# EAGLE design ir-leds (EAGLE 9.1.3)
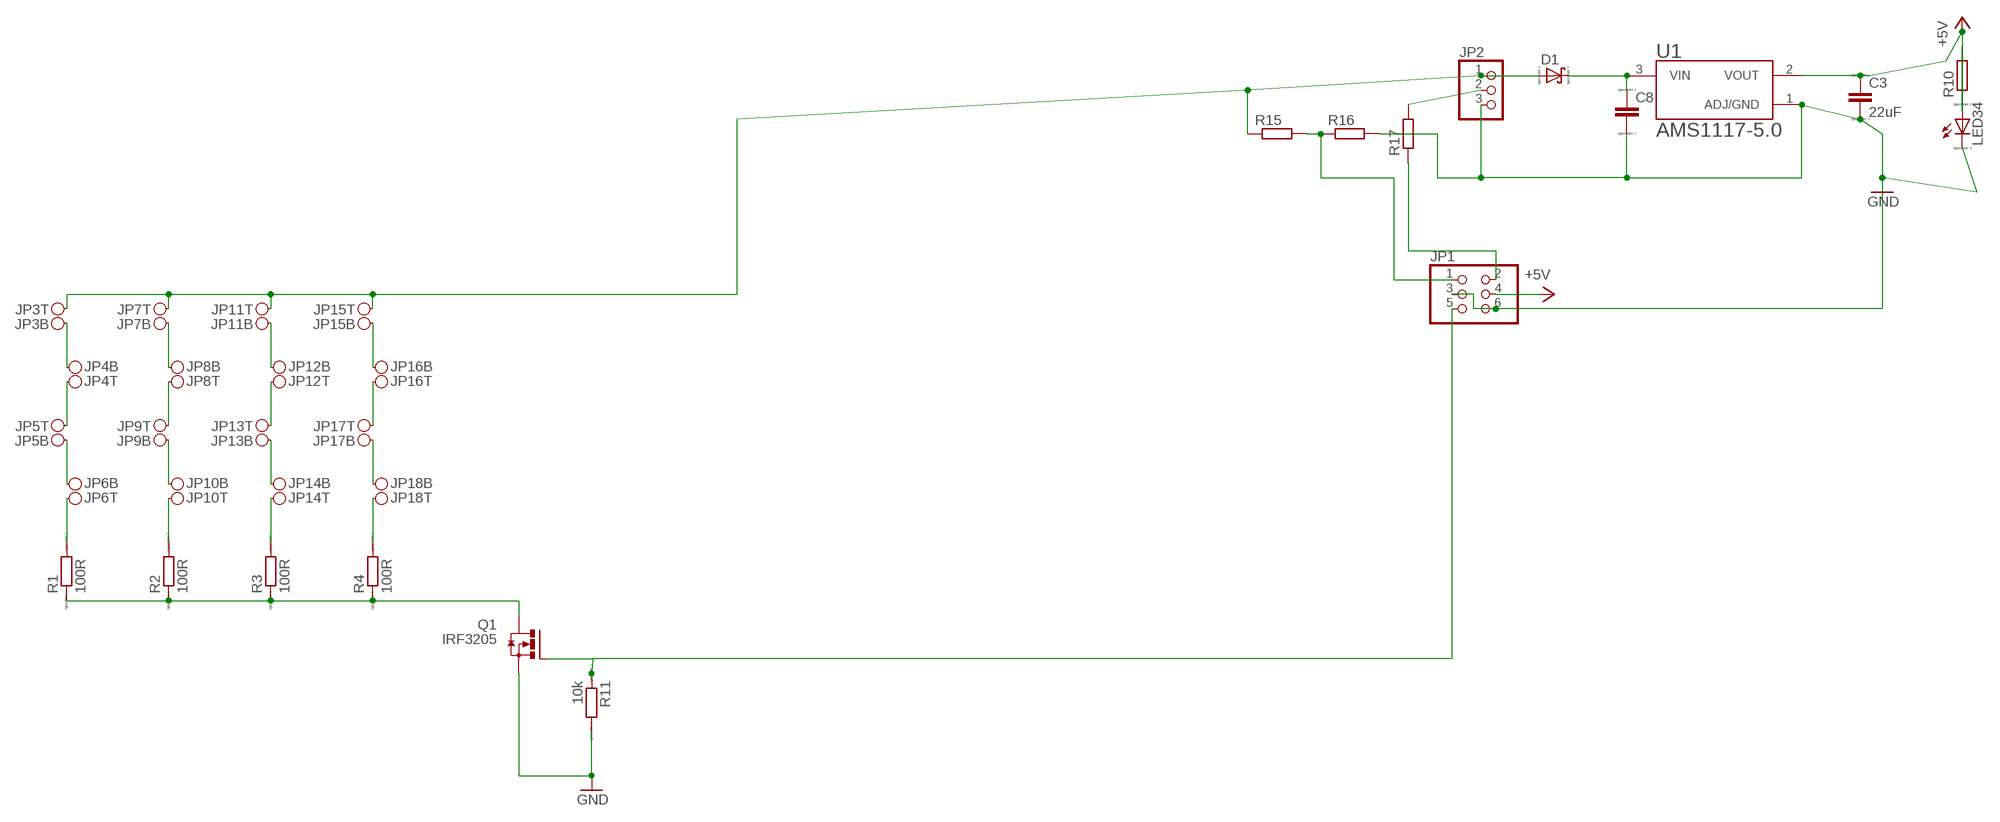
[diagram p0: schematic, sheet 1]

## Parts
C3  22uF  CC1206  [C1206]
C8  CC1206  [C1206]
D1  SCHOTTKY-DIODEF126Z12  [DIODE_F126Z12]
JP1  PINHD-2X3  [2X03]
JP2  PINHD-1X3  [1X03]
JP3  PINH2X01  [PINH2X01SMD]
JP4  PINH2X01  [PINH2X01SMD]
JP5  PINH2X01  [PINH2X01SMD]
JP6  PINH2X01  [PINH2X01SMD]
JP7  PINH2X01  [PINH2X01SMD]
JP8  PINH2X01  [PINH2X01SMD]
JP9  PINH2X01  [PINH2X01SMD]
JP10  PINH2X01  [PINH2X01SMD]
JP11  PINH2X01  [PINH2X01SMD]
JP12  PINH2X01  [PINH2X01SMD]
JP13  PINH2X01  [PINH2X01SMD]
JP14  PINH2X01  [PINH2X01SMD]
JP15  PINH2X01  [PINH2X01SMD]
JP16  PINH2X01  [PINH2X01SMD]
JP17  PINH2X01  [PINH2X01SMD]
JP18  PINH2X01  [PINH2X01SMD]
LED34  LED_E  [LED_1206]
Q1  IRF3205  IRF3704L-V  [TO262-V]
R1  100R  RR1206  [R1206]
R2  100R  RR1206  [R1206]
R3  100R  RR1206  [R1206]
R4  100R  RR1206  [R1206]
R10  R-EU_R1206  [R1206]
R11  10k  RR1206  [R1206]
R15  R-EU_R1206  [R1206]
R16  R-EU_R1206  [R1206]
R17  R-EU_R1206  [R1206]
U1  AMS1117-5.0  [SOT229P700X180-4N]

## Nets
+5V: C3.1 JP1.4 R10.2 U1.2(VOUT)
GND: C3.2 C8.2 JP1.3 JP1.6 JP2.3 LED34.C Q1.3(S) R11.2 R16.2 U1.1(ADJ/GND)
N$1: JP3.B1 JP4.B1
N$2: JP4.T1 JP5.T1
N$3: JP5.B1 JP6.B1
N$4: JP6.T1 R1.2
N$5: JP10.T1 R2.2
N$6: JP9.B1 JP10.B1
N$7: JP8.T1 JP9.T1
N$8: JP7.B1 JP8.B1
N$9: JP11.B1 JP12.B1
N$10: JP12.T1 JP13.T1
N$11: JP13.B1 JP14.B1
N$12: JP14.T1 R3.2
N$13: JP15.B1 JP16.B1
N$14: JP16.T1 JP17.T1
N$15: JP17.B1 JP18.B1
N$16: JP18.T1 R4.2
N$17: JP1.2 R17.1
N$33: D1.A(C) JP2.1 JP3.T1 JP7.T1 JP11.T1 JP15.T1 R15.1
N$34: JP1.5 Q1.1(G) R11.1
N$35: Q1.2(D) R1.1 R2.1 R3.1 R4.1
N$36: LED34.A R10.1
N$38: JP2.2 R17.2
N$39: JP1.1 R15.2 R16.1
N$44: C8.1 D1.C(A) U1.3(VIN)

## Library data of the parts
C3 C8 = eagle-ltspice:C: CAPACITOR, European symbol; SPICEMODEL: NONE; SPICEPREFIX: C
D1 = eagle-ltspice:SCHOTTKY-DIODE: Schottky Diode; SPICEMODEL: NONE; SPICEPREFIX: D; SPICETYPE: diode
JP1 = pinhead:PINHD-2X3: PIN HEADER
JP2 = pinhead:PINHD-1X3: PIN HEADER
JP3-JP18 = pinhead_smd:PINH2X01
LED34 = eagle-ltspice:LED_E: LED Source: http://www.osram.convergy.de Source: www.luxeon.com Source: www.kingbright.com; SPICEMODEL: NONE; SPICEPREFIX: D; SPICETYPE: diode
Q1 = transistor-power:IRF3704: SMPS MOSFET HEXFET® Power MOSFET Source: http://www.irf.com/product-info/datasheets/data/irf3704.pdf
R1-R4 R11 = eagle-ltspice:R: RESISTOR, European symbol; SPICEMODEL: NONE; SPICEPREFIX: R
R10 R15-R17 = resistor:R-EU_: RESISTOR, European symbol
U1 = AMS1117-5.0:AMS1117-5.0: Sot223/Pkg 1-Amp 5-Volt Low Drop Out Voltage Regulatator; AVAILABILITY: Unavailable; DESCRIPTION: Sot223/Pkg 1-Amp 5-Volt Low Drop Out Voltage Regulatator; MF: Advanced Monolithic Systems; MP: AMS1117-5.0; PACKAGE: None; PRICE: None

## Net classes
0 default: width 0.406 mm

## Board
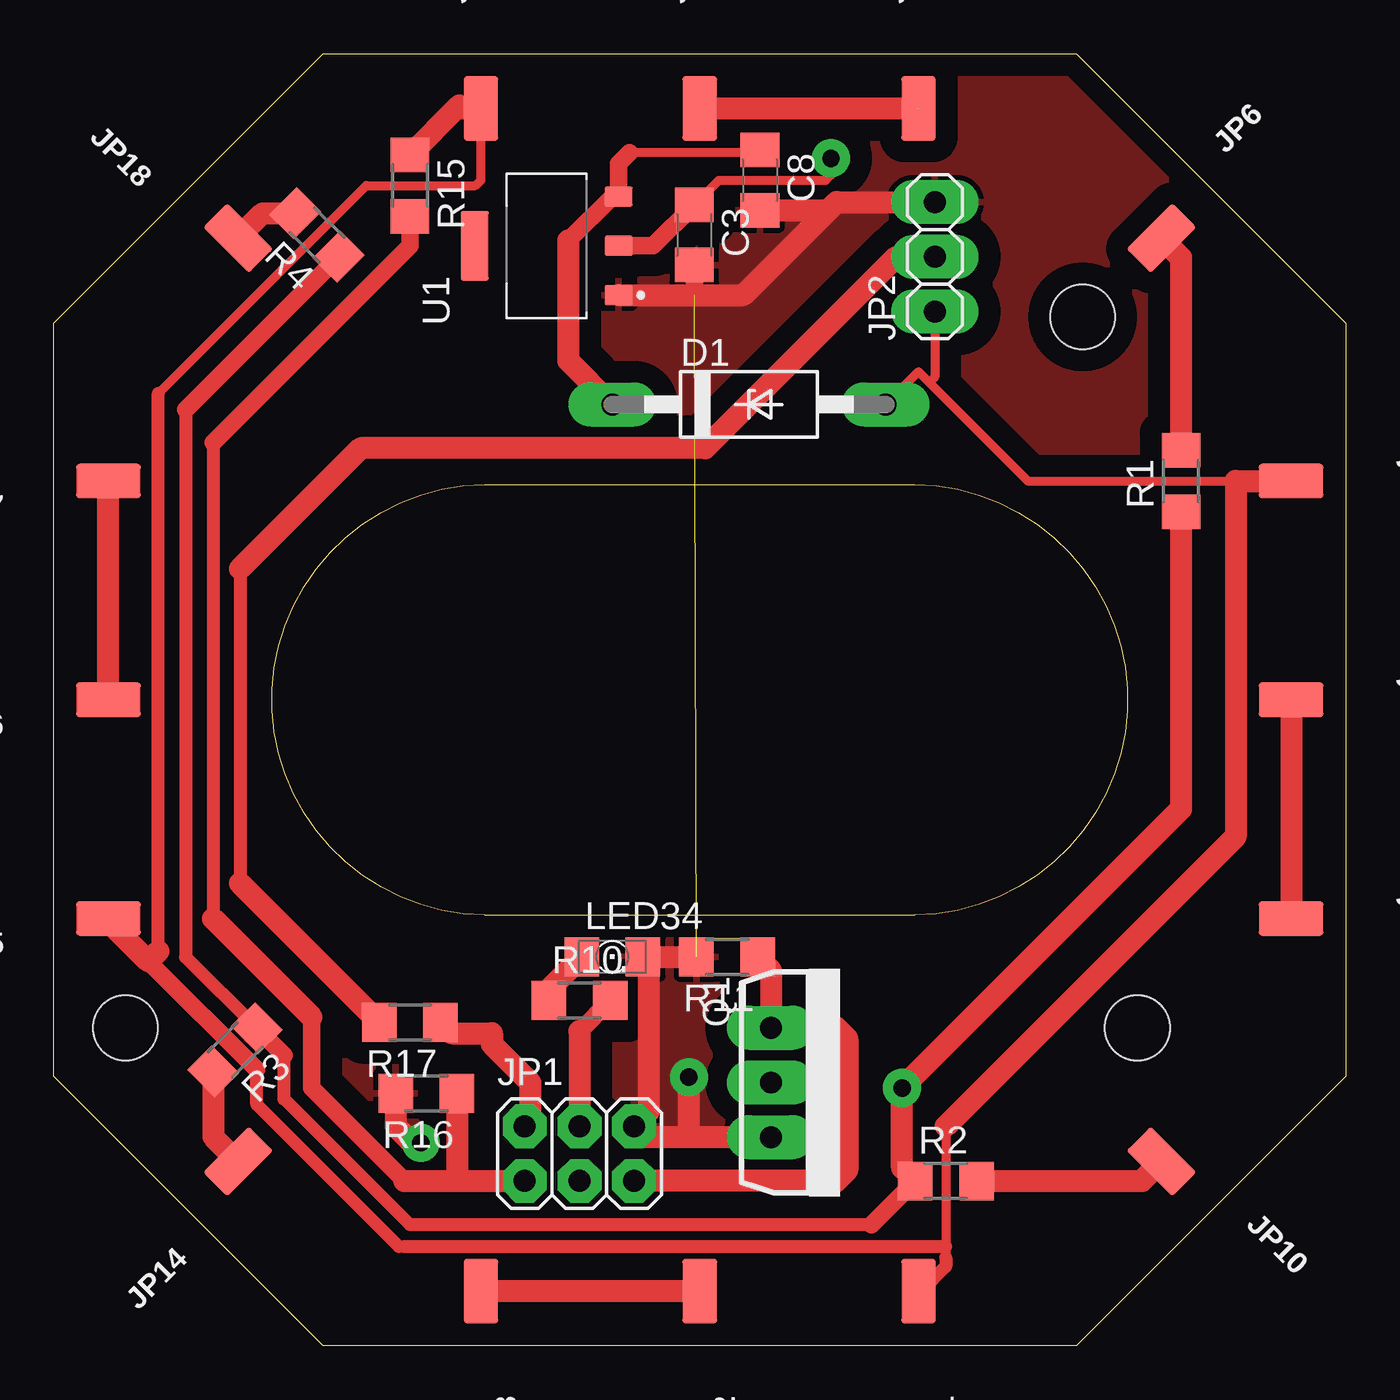
[diagram p1: board, top side]
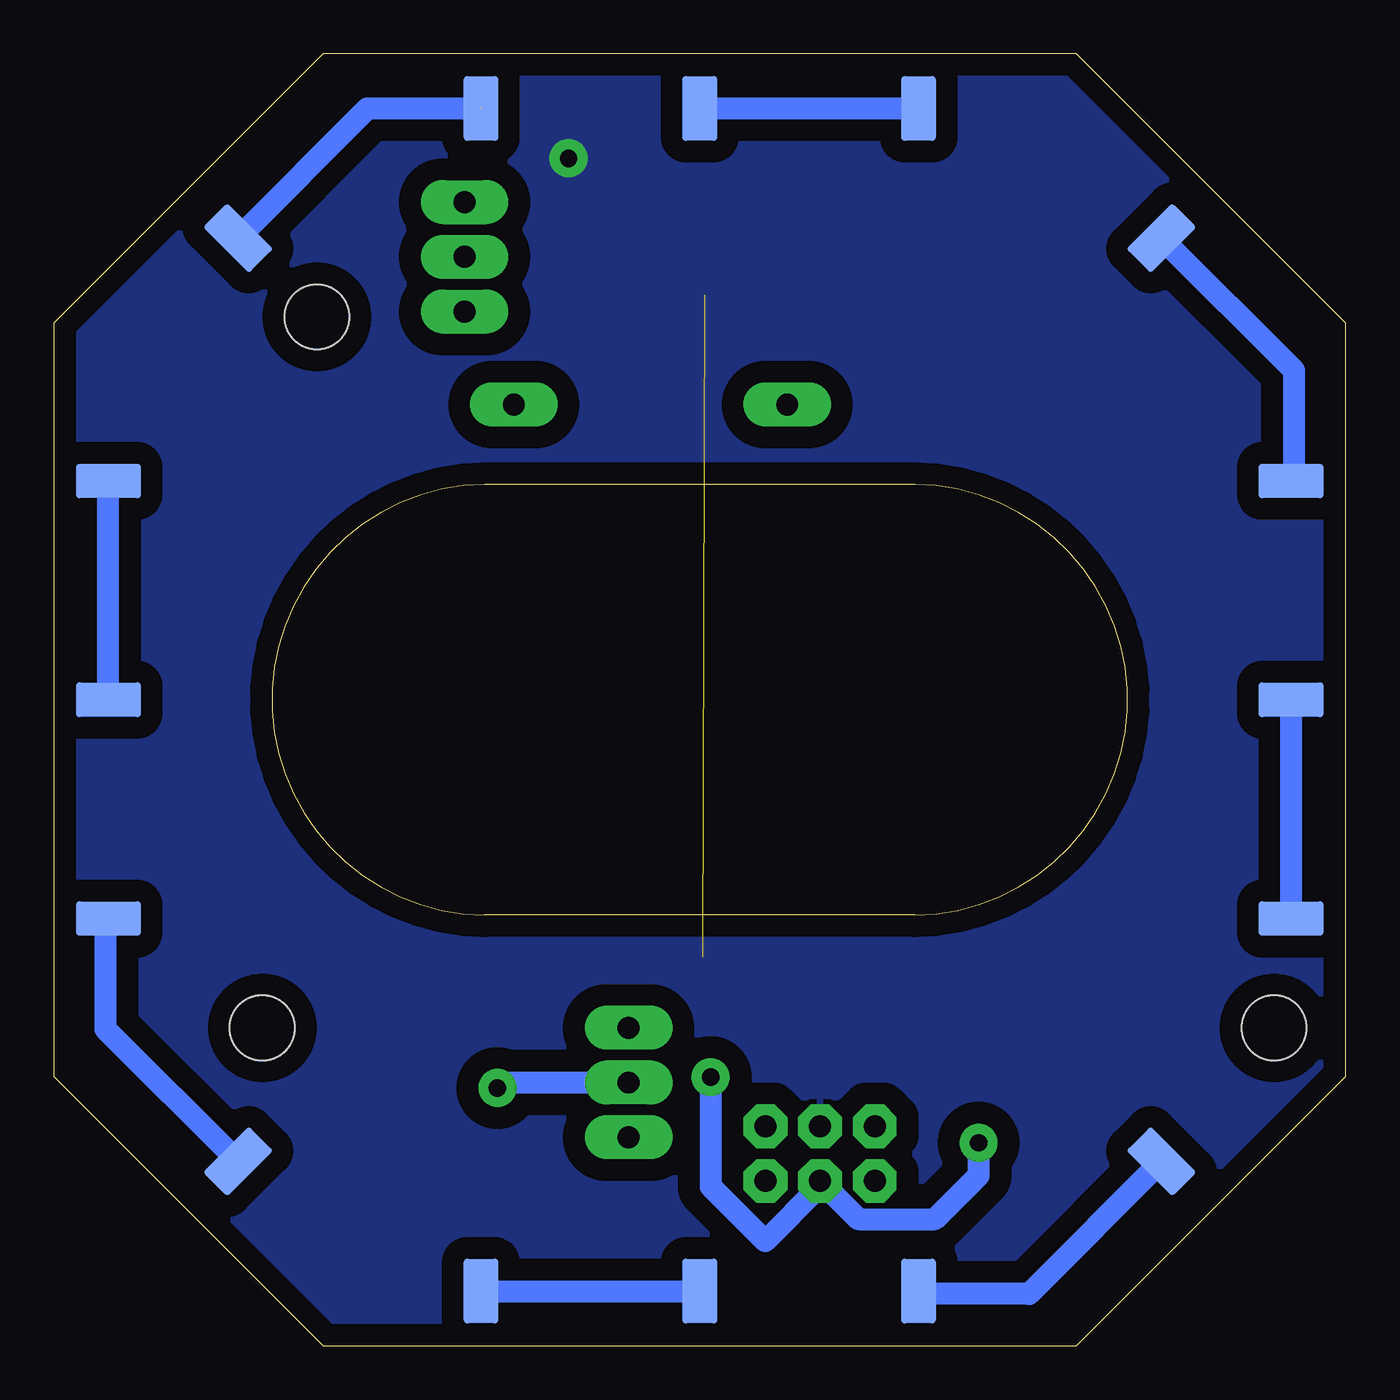
[diagram p2: board, bottom side, seen from below]

Size 60 x 60 mm. Coordinates in mm from the lower left corner, seen from the top.
Outline: 60,12.5 47.5,0 12.5,0 0,12.5 0,47.5 12.5,60 47.5,60 60,47.5 60,12.5
Outline: 20,40 40,40 arc-179 40,20 20,20 arc-179 20,40
Copper layers (1*16): Top 0.035mm / dielectric 1.5mm / Bottom 0.035mm
Design rules "rucni": minimum track width 10mil, minimum drill 0.8mm, track to track 10mil, track to pad 10mil, pad to pad 10mil, via to via 10mil, smd to smd 10mil, copper to edge 40mil, drill to drill 10mil, minimum pad ring 10mil, minimum via ring 8mil, stop-mask expansion 4mil, vias tented up to drill 0mil, thermal gap 10mil
Holes 3 mm at 50.32,14.76 3.33,14.76 47.78,47.78

### Footprints (pad centres in the part's own frame; a part is rotated, then mirrored left to right if it is on the bottom)
C1206 = smd 1.6 x 1.8: 1 -1.4,0; 2 1.4,0
DIODE_F126Z12 = drill 1.016 long: A 6.35,0; C -6.35,0
2X03 = drill 1.016 octagon: 1 -2.54,-1.27; 2 -2.54,1.27; 3 0,-1.27; 4 0,1.27; 5 2.54,-1.27; 6 2.54,1.27
1X03 = drill 1.016 long: 1 -2.54,0; 2 0,0; 3 2.54,0
PINH2X01SMD = smd 1.6 x 3 bottom: B1 0,-2 | smd 1.6 x 3: T1 0,-2
LED_1206 = smd 1.6 x 1.803: A -1.422,0; C 1.422,0
TO262-V = drill 1.016 long: 1 -2.54,0; 2 0,0; 3 2.54,0
R1206 = smd 1.6 x 1.803: 1 -1.422,0; 2 1.422,0
SOT229P700X180-4N = smd 0.93 x 1.31: 1 -2.29,-3.345; 2 0,-3.345; 3 2.29,-3.345 | smd 3.24 x 1.31: 4 0,3.345

### Placement (x,y rotation side)
C3  29.75,51.59 270 top
C8  32.79,54.13 270 top
D1  32.29,43.72 0 top
JP1  24.41,8.92 0 top
JP2  40.92,50.57 90 top
JP3  19.84,59.46 0 top
JP4  30,59.46 0 top
JP5  40.16,59.46 0 top
JP6  52.86,52.86 315 top
JP7  59.46,40.16 270 top
JP8  59.46,30 270 top
JP9  59.46,19.84 270 top
JP10  52.86,7.14 225 top
JP11  40.16,0.54 180 top
JP12  30,0.54 180 top
JP13  19.84,0.54 180 top
JP14  7.14,7.14 135 top
JP15  0.54,19.84 90 top
JP16  0.54,30 90 top
JP17  0.54,40.16 90 top
JP18  7.14,52.86 45 top
LED34  25.94,18.06 0 top
Q1  33.3,12.22 270 top
R1  52.35,40.16 90 top
R2  41.43,7.65 0 top
R3  8.41,13.74 225 top
R4  12.22,51.59 135 top
R10  24.41,16.03 0 top
R11  31.27,18.06 180 top
R15  16.54,53.88 270 top
R16  17.3,11.71 180 top
R17  16.54,15.01 180 top
U1  22.89,51.08 90 top

### Tracks (layer width: path | path; a pad name or v marks a point on that pad's centre or on a via)
+5V  (via drill 0.8)
  Top 0.406: C3.1 30.89,54.13 35.84,54.13 36.1,54.38 v36.1,55.15
  Top 0.813: C3.1 27.84,51.08 U1.2 | R10.2 24.41,14.61
  Top 1.016: 24.41,14.61 JP1.4
  pour Bottom (isolate 1.016): 0.03,47.53 12.47,59.97 47.53,59.97 59.97,47.53 59.97,12.47 47.53,0.03 12.47,0.03 0.03,12.47
GND  (via drill 0.8)  (1 unrouted)
  Top 0.406: 35.97,52.73
  Top 0.813: C3.2 29.75,48.79
  Top 1.016: Q1.3 29.49,9.68 | 29.49,9.68 27.46,9.68 JP1.6 27.61,10.85 27.61,17.81 LED34.C R11.2 | U1.1 29.75,48.79 32.03,48.79 35.97,52.73 36.35,53.11 JP2.3 | C8.2 35.97,52.73 | R16.2 15.88,10.19 16.64,9.43 v17.05,9.43 | 29.49,9.68 v29.49,12.47
  Bottom 0.406: 24.41,7.39 JP1.3
  Bottom 1.016: v29.49,12.47 29.49,7.39 26.95,4.85 24.41,7.39 | JP1.3 22.63,5.87 19.08,5.87 17.05,7.9 v17.05,9.43
  pour Top (isolate 1.016): 0.03,12.47 12.47,0.03 47.53,0.03 59.97,12.47 59.97,47.27 47.27,59.97 12.47,59.97 0.03,47.53
N$1
  Bottom 1.016: JP4.B1 JP3.B1
N$2  (1 unrouted)
  Top 0.406: 40.67,57.18 40.26,57.59 40.13,57.46
  Top 1.016: JP4.T1 40.13,57.46
N$3
  Bottom 1.016: JP6.B1 45.43,57.46 JP5.B1
N$4
  Top 1.016: JP6.T1 52.35,50.54 R1.2
N$5
  Top 1.016: R2.2 50.54,7.65 JP10.T1
N$6
  Bottom 0.406: 57.59,19.71 JP9.B1
  Bottom 1.016: JP10.B1 57.59,14.7 57.59,19.71
N$7
  Top 1.016: JP8.T1 JP9.T1
N$8
  Bottom 1.016: JP8.B1 JP7.B1
N$9
  Bottom 1.016: JP11.B1 JP12.B1
N$10
  Top 1.016: JP12.T1 JP13.T1
N$11
  Bottom 0.406: 19.71,2.41 JP13.B1
  Bottom 1.016: JP14.B1 14.7,2.41 19.71,2.41
N$12
  Top 1.016: R3.2 7.4,9.7 JP14.T1
N$13
  Bottom 1.016: JP15.B1 JP16.B1
N$14
  Top 1.016: JP16.T1 JP17.T1
N$15
  Bottom 0.406: 2.41,40.29 JP17.B1
  Bottom 1.016: JP18.B1 2.41,45.3 2.41,40.29
N$16
  Top 1.016: JP18.T1 9.7,52.6 R4.2
N$17
  Top 0.406: 22.13,10.44 JP1.2 | R17.1 18.47,14.51
  Top 1.016: 18.47,14.51 20.35,14.51 20.35,14 22.13,12.22 22.13,10.44
N$33
  Top 0.406: JP2.1 40.92,44.99 40.67,44.73 | D1.A 40.16,45.24 40.67,44.73 | 40.67,44.73 45.24,40.16 54.89,40.16 | 41.43,4.6 41.43,4.09 41.43,10.19 | 16.28,4.6 16.03,4.6 | 4.85,44.22 14.51,53.88 19.59,53.88 19.84,54.13 JP3.T1 | 40.29,2.54 JP11.T1 | 2.54,19.71 JP15.T1 | 18.83,57.59 18.96,57.46
  Top 0.61: 41.43,4.09 41.43,3.68 40.29,2.54 | 41.43,4.6 17.65,4.6 16.28,4.6 | 16.03,4.6 9.43,11.2 9.43,12.82 | 4.85,18.32 4.85,44.22
  Top 0.813: 9.43,12.82 4.39,17.86
  Top 1.016: JP7.T1 54.89,40.16 54.89,23.65 41.43,10.19 | 4.85,18.32 4.39,17.86 2.54,19.71 | R15.1 18.83,57.59 | 18.96,57.46 JP3.T1
N$34
  Top 1.016: JP1.5 36.35,7.65 36.86,8.16 36.86,14.25 36.35,14.76 Q1.1 33.3,17.45 R11.1
N$35  (via drill 0.8)
  Top 0.406: R2.1 39.4,8.26 | 9.44,14.75 R3.1
  Top 0.61: 37.98,5.62 18.57,5.62 17.05,5.62 16.54,5.62 10.7,11.46 10.7,13.49 | R3.1 6.12,18.04 6.12,43.48
  Top 0.813: R2.1 37.98,5.62 | 10.7,13.49 9.44,14.75 | R4.1 6.12,43.48
  Top 1.016: 39.4,8.26 v39.4,11.97 52.35,24.92 R1.1
  Bottom 0.406: v39.4,11.97 39.14,12.22
  Bottom 1.016: 39.14,12.22 Q1.2
N$36
  Top 0.406: R10.1 22.99,16.54
  Top 1.016: 22.99,16.54 LED34.A
N$38
  Top 0.406: JP2.2 39.14,50.57
  Top 0.61: 8.65,36.09 8.65,21.48
  Top 1.016: 39.14,50.57 30.25,41.68 14.25,41.68 8.65,36.09 | 8.65,21.48 R17.2
N$39
  Top 0.406: 18.72,7.75 18.82,7.65
  Top 0.61: 7.39,41.94 7.39,19.84
  Top 0.813: R15.2 16.54,51.08 7.39,41.94 | 11.97,15.27 11.97,11.97 16.28,7.65
  Top 1.016: 7.39,19.84 11.97,15.27 | 16.28,7.65 18.82,7.65 JP1.1 | R16.1 18.72,7.75
N$44
  Top 0.406: 26.74,55.4 32.67,55.4 C8.1 | 25.94,53.37 U1.3
  Top 0.813: 26.74,55.4 26.23,54.9 U1.3 | 23.9,51.34 25.94,53.37
  Top 1.016: D1.C 23.9,45.75 23.9,51.34